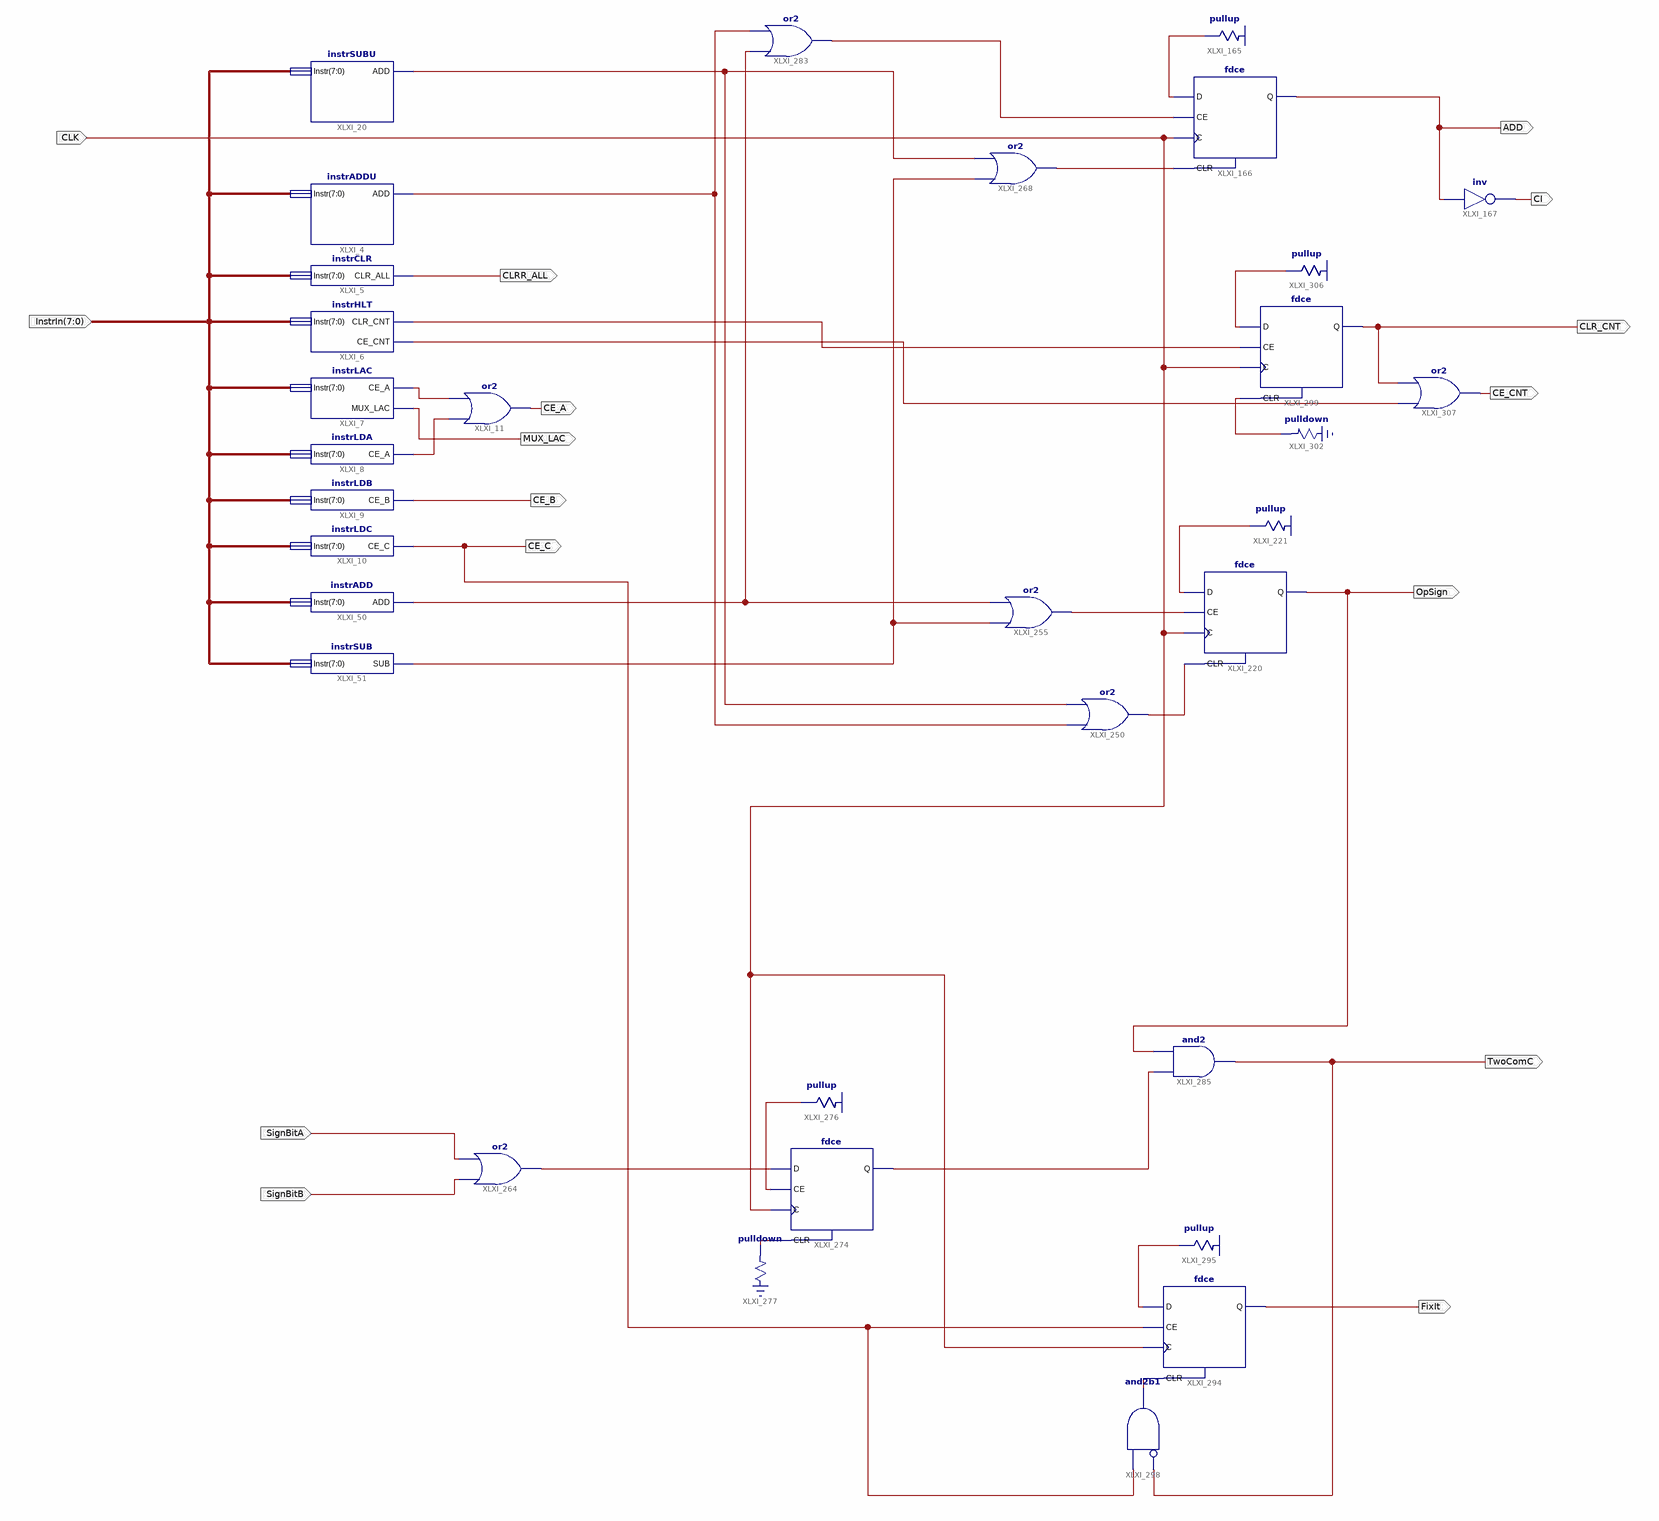
[diagram p0: schematic sheet 1]
// Xilinx ISE schematic InstrDecoder.sch (spartan3e) as structural Verilog: 32 symbols, 16 ports
module InstrDecoder (
  input  [7:0] InstrIn,
  input  CLK,
  input  SignBitA,
  input  SignBitB,
  output CE_A,
  output CLRR_ALL,
  output MUX_LAC,
  output CE_B,
  output CE_C,
  output CI,
  output ADD,
  output OpSign,
  output TwoComC,
  output FixIt,
  output CE_CNT,
  output CLR_CNT
);

  wire XLXN_3, XLXN_4, XLXN_415, XLXN_431, XLXN_523, XLXN_594, XLXN_704, XLXN_706, XLXN_710, XLXN_787,
       XLXN_788, XLXN_807, XLXN_808, XLXN_825, XLXN_843, XLXN_913, XLXN_926, XLXN_933, XLXN_946, XLXN_952,
       XLXN_966, XLXN_968;

  instrADDU XLXI_4 (.Instr(InstrIn), .ADD(XLXN_431));
  instrCLR XLXI_5 (.Instr(InstrIn), .CLR_ALL(CLRR_ALL));
  instrHLT XLXI_6 (.Instr(InstrIn), .CLR_CNT(XLXN_966), .CE_CNT(XLXN_968));
  instrLAC XLXI_7 (.Instr(InstrIn), .CE_A(XLXN_3), .MUX_LAC(MUX_LAC));
  instrLDA XLXI_8 (.Instr(InstrIn), .CE_A(XLXN_4));
  instrLDB XLXI_9 (.Instr(InstrIn), .CE_B(CE_B));
  instrLDC XLXI_10 (.Instr(InstrIn), .CE_C(CE_C));
  instrADD XLXI_50 (.Instr(InstrIn), .ADD(XLXN_807));
  instrSUB XLXI_51 (.Instr(InstrIn), .SUB(XLXN_808));
  or XLXI_11 (CE_A, XLXN_4, XLXN_3);
  instrSUBU XLXI_20 (.Instr(InstrIn), .ADD(XLXN_706));
  not XLXI_167 (CI, ADD);
  fdce XLXI_166 (.C(CLK), .CE(XLXN_594), .CLR(XLXN_704), .D(XLXN_415), .Q(ADD));
  \pullup  XLXI_165 (.O(XLXN_415));
  fdce XLXI_220 (.C(CLK), .CE(XLXN_710), .CLR(XLXN_913), .D(XLXN_523), .Q(OpSign));
  \pullup  XLXI_221 (.O(XLXN_523));
  or XLXI_250 (XLXN_913, XLXN_431, XLXN_706);
  or XLXI_255 (XLXN_710, XLXN_808, XLXN_807);
  or XLXI_268 (XLXN_704, XLXN_808, XLXN_706);
  or XLXI_283 (XLXN_594, XLXN_807, XLXN_431);
  \pullup  XLXI_276 (.O(XLXN_787));
  \pulldown  XLXI_277 (.O(XLXN_788));
  fdce XLXI_274 (.C(CLK), .CE(XLXN_787), .CLR(XLXN_788), .D(XLXN_825), .Q(XLXN_843));
  or XLXI_264 (XLXN_825, SignBitB, SignBitA);
  and XLXI_285 (TwoComC, XLXN_843, OpSign);
  fdce XLXI_294 (.C(CLK), .CE(CE_C), .CLR(XLXN_933), .D(XLXN_926), .Q(FixIt));
  \pullup  XLXI_295 (.O(XLXN_926));
  and XLXI_298 (XLXN_933, ~TwoComC, CE_C);  // and2b1
  \pulldown  XLXI_302 (.O(XLXN_946));
  fdce XLXI_299 (.C(CLK), .CE(XLXN_966), .CLR(XLXN_946), .D(XLXN_952), .Q(CLR_CNT));
  or XLXI_307 (CE_CNT, XLXN_968, CLR_CNT);
  \pullup  XLXI_306 (.O(XLXN_952));
endmodule
